# Altium schematic sheet Serial.SchDoc
size A
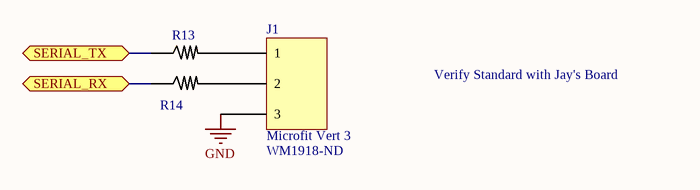
[diagram p0: Serial.SchDoc]

## Parts
J1  Microfit Vert 3  Supplier Part Number 1: WM1918-ND  [MICRO-FIT 3 POS VERT THROUGH HOLE]
R13  0603 Res  [0603/1608 SMD Resistor]  (value not drawn)
R14  0603 Res  [0603/1608 SMD Resistor]  (value not drawn)

## Ports
SERIAL_RX, SERIAL_TX

## Nets
GND: J1.3
SERIAL_RX: R14.1 ; port SERIAL_RX
SERIAL_TX: R13.1 ; port SERIAL_TX
NetJ1_1: J1.1 R13.2
NetJ1_2: J1.2 R14.2

## Notes on the sheet
- Verify Standard with Jay's Board

## Library data of the parts
J1 = Micro-fit 3 Pos Vertical Through Hole: Supplier 1: Digi-Key
R13 R14 = 0603 Res: 220 Ohm Res